# EAGLE design eagle (EAGLE 6.6.0)
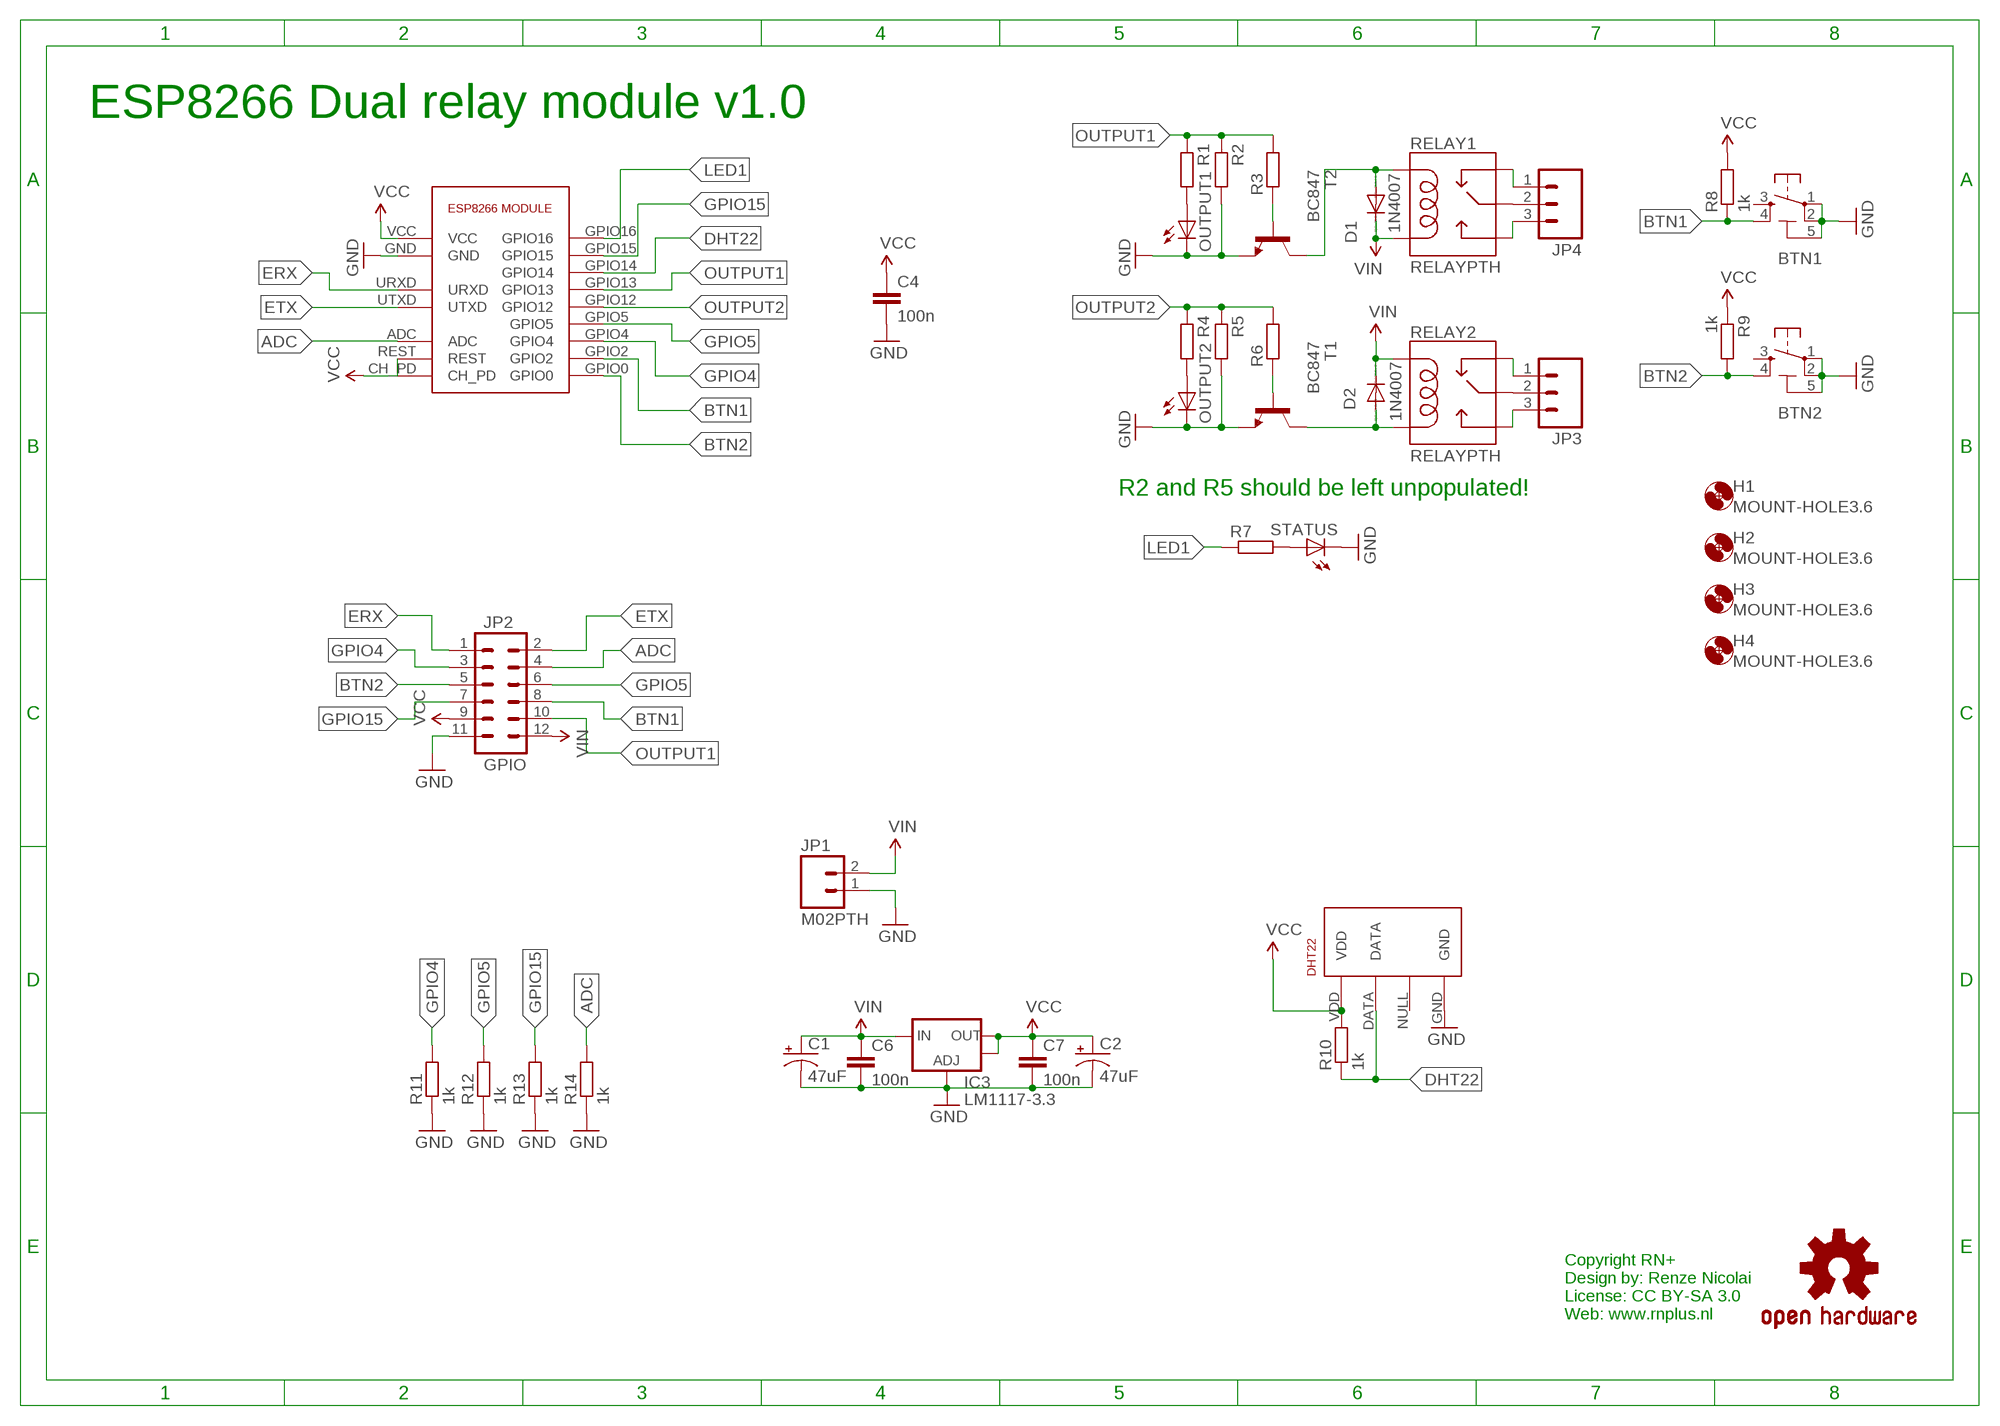
[diagram p0: schematic, sheet 1]

## Parts
BTN1  SMARTPRJ_TS42  [SMARTPRJ_TS42]
BTN2  SMARTPRJ_TS42  [SMARTPRJ_TS42]
C1  47uF  CAP_POLD  [PANASONIC_D]
C2  47uF  CAP_POLD  [PANASONIC_D]
C4  100n  C-EUC0805K  [C0805K]
C6  100n  C-EUC0805K  [C0805K]
C7  100n  C-EUC0805K  [C0805K]
D1  1N4942  [DO41-10]
D2  1N4942  [DO41-10]
DHT22  RHT03_DHT-22_AM2302  [RHT03_DHT-22]
ESP8266  ESP8266ESP-07  [ESP-12]
H1  MOUNT-HOLE3.6  [3,6]
H2  MOUNT-HOLE3.6  [3,6]
H3  MOUNT-HOLE3.6  [3,6]
H4  MOUNT-HOLE3.6  [3,6]
IC3  LM1117-3.3  V_REG_LM1117SOT223  [SOT223]
JP1  M02PTH  [1X02]
JP2  GPIO  M06X2PTH_FEMALE  [2X6]
JP3  M03-SCREW-5MM  [SCREWTERMINAL-5MM-3]
JP4  M03-SCREW-5MM  [SCREWTERMINAL-5MM-3]
LOGO1  OSHW-LOGOL  [OSHW-LOGO-L]
OUTPUT1  LEDCHIP-LED0805  [CHIP-LED0805]
OUTPUT2  LEDCHIP-LED0805  [CHIP-LED0805]
R1  SMARTPRJ_R-EU_M0805  [SMARTPRJ_M0805]
R2  SMARTPRJ_R-EU_M0805  [SMARTPRJ_M0805]
R3  SMARTPRJ_R-EU_M0805  [SMARTPRJ_M0805]
R4  SMARTPRJ_R-EU_M0805  [SMARTPRJ_M0805]
R5  SMARTPRJ_R-EU_M0805  [SMARTPRJ_M0805]
R6  SMARTPRJ_R-EU_M0805  [SMARTPRJ_M0805]
R7  SMARTPRJ_R-EU_M0805  [SMARTPRJ_M0805]
R8  1k  SMARTPRJ_R-EU_M0805  [SMARTPRJ_M0805]
R9  1k  SMARTPRJ_R-EU_M0805  [SMARTPRJ_M0805]
R10  1k  SMARTPRJ_R-EU_M0805  [SMARTPRJ_M0805]
R11  1k  SMARTPRJ_R-EU_M0805  [SMARTPRJ_M0805]
R12  1k  SMARTPRJ_R-EU_M0805  [SMARTPRJ_M0805]
R13  1k  SMARTPRJ_R-EU_M0805  [SMARTPRJ_M0805]
R14  1k  SMARTPRJ_R-EU_M0805  [SMARTPRJ_M0805]
RELAY1  RELAYPTH  [SRD-05VDC-SL-C]
RELAY2  RELAYPTH  [SRD-05VDC-SL-C]
STATUS  LEDCHIP-LED0805  [CHIP-LED0805]
T1  BC847  [SOT23]
T2  BC847  [SOT23]

## Nets
ADC: ESP8266.ADC JP2.4 R14.2
BTN1: BTN1.4 ESP8266.GPIO2 JP2.8 R8.1
BTN2: BTN2.4 ESP8266.GPIO0 JP2.5 R9.2
DHT22: DHT22.DATA ESP8266.GPIO14 R10.1
ERX: ESP8266.URXD JP2.1
ETX: ESP8266.UTXD JP2.2
GND: BTN1.1 BTN1.2 BTN1.5(5-GND) BTN2.1 BTN2.2 BTN2.5(5-GND) C1.- C2.- C4.2 C6.2 C7.2 DHT22.GND ESP8266.GND IC3.1(ADJ) JP1.1 JP2.11 OUTPUT1.C OUTPUT2.C R2.2 R5.2 R11.1 R12.1 R13.1 R14.1 STATUS.C T1.2(E) T2.2(E)
GPIO4: ESP8266.GPIO4 JP2.3 R11.2
GPIO5: ESP8266.GPIO5 JP2.6 R12.2
GPIO15: ESP8266.GPIO15 JP2.7 R13.2
LED1: ESP8266.GPIO16 R7.1
N$1: D2.A RELAY2.COIL0 T1.3(C)
N$2: D1.A RELAY1.COIL1 T2.3(C)
N$3: JP3.2 RELAY2.SWCOMMON
N$4: JP4.2 RELAY1.SWCOMMON
N$5: JP4.1 RELAY1.SWCLOSED(SWCLOSE)
N$6: JP4.3 RELAY1.SWOPEN
N$7: JP3.3 RELAY2.SWOPEN
N$8: JP3.1 RELAY2.SWCLOSED(SWCLOSE)
N$9: R3.1 T2.1(B)
N$10: R6.1 T1.1(B)
N$13: OUTPUT2.A R4.2
N$14: R7.2 STATUS.A
N$17: OUTPUT1.A R1.2
OUTPUT1: ESP8266.GPIO13 JP2.10 R1.1 R2.1 R3.2
OUTPUT2: ESP8266.GPIO12 R4.1 R5.1 R6.2
VCC: C2.+ C4.1 C7.1 DHT22.VDD ESP8266.CH_PD ESP8266.REST ESP8266.VCC IC3.2(OUT) IC3.4(OUT) JP2.9 R8.2 R9.1 R10.2
VIN: C1.+ C6.1 D1.C D2.C IC3.3(IN) JP1.2 JP2.12 RELAY1.COIL0 RELAY2.COIL1
Unconnected: BTN1.3 BTN2.3 DHT22.NULL

## Notes on the sheet
- ESP8266 Dual relay module v1.0
- 1N4007
- 1N4007
- R2 and R5 should be left unpopulated!
- Copyright RN+
  Design by: Renze Nicolai
  License: CC BY-SA 3.0
  Web: www.rnplus.nl

## Library data of the parts
BTN1 BTN2 = arduino_Uno_Rev3-02-TH:SMARTPRJ_TS42: TS42 Dongnan Electronics Tact switch VDC 12V - 50mA
C1 C2 = SparkFun-Capacitors:CAP_POL: Capacitor Polarized These are standard SMD and PTH capacitors. Normally 10uF, 47uF, and 100uF in electrolytic and tantalum varieties. Always verify the external diameter of the through hole cap, it varies with capacity, voltage, and manufacturer. The EIA devices should be standard.
C4 C6 C7 = rcl:C-EU: CAPACITOR, European symbol
D1 D2 = diode:1N4942: DIODE 1.0 A, 200 V, 150 ns
DHT22 = dht:RHT03_DHT-22_AM2302: RHT03 / DHT-22 / AM2302 Packages and symbol for the RHT03 / DHT-22 relative humidity and temperature sensor. Note: The AM2302 is a wired version of the DHT-22 which typically requires less clearance and is thus provided as a separate package.; PROD_ID: SEN-10167
ESP8266 = esp:ESP8266
H1-H4 = holes:MOUNT-HOLE: MOUNTING HOLE with drill center marker
IC3 = SparkFun-PowerIC:V_REG_LM1117: Voltage Regulator LM1117 Standard adjustable voltage regulator but in SMD form. Spark Fun Electronics SKU : COM-00595
JP1 = SparkFun-Connectors:M02: Standard 2-pin 0.1" header. Use with - straight break away headers ( PRT-00116) - right angle break away headers (PRT-00553) - swiss pins (PRT-00743) - machine pins (PRT-00117) - female headers (PRT-00115) Molex polarized connector foot print use with: PRT-08233 with associated crimp pins and housings. 2.54_SCREWTERM for use with PRT-10571. 3.5mm Screw Terminal footprints for PRT-08084 5mm Screw Terminal footprints for use with PRT-08432
JP2 = SparkFun-Connectors:M06X2; PROD_ID: CONN-12423; VALUE: 2X6 FEMALE
JP3 JP4 = SparkFun-Connectors:M03: Header 3 Standard 3-pin 0.1" header. Use with straight break away headers (SKU : PRT-00116), right angle break away headers (PRT-00553), swiss pins (PRT-00743), machine pins (PRT-00117), and female headers (PRT-00115). Molex polarized connector foot print use with SKU : PRT-08232 with associated crimp pins and housings.; STOREFRONT_ID: PRT-08433
LOGO1 = SparkFun-Aesthetics:OSHW-LOGO: Open Source Hardware Logo This logo indicates the piece of hardware it is found on incorporates a OSHW license and/or adheres to the definition of open source hardware found here: http://freedomdefined.org/OSHW
OUTPUT1 OUTPUT2 STATUS = led:LED: LED OSRAM: - CHIPLED LG R971, LG N971, LY N971, LG Q971, LY Q971, LO R971, LY R971 LH N974, LH R974 LS Q976, LO Q976, LY Q976 LO Q996 - Hyper CHIPLED LW Q18S LB Q993, LB Q99A, LB R99A - SideLED LS A670, LO A670, LY A670, LG A670, LP A670 LB A673, LV A673, LT A673, LW A673 LH A674 LY A675 LS A676, LA A676, LO A676, LY A676, LW A676 LS A679, LY A679, LG A679 - Hyper Micro SIDELED® LS Y876, LA Y876, LO Y876, LY Y876 LT Y87S - SmartLED LW L88C, LW L88S LB L89C, LB L89S, LG L890 LS L89K, LO L89K, LY L89K LS L896, LA L896, LO L896, LY L896 - TOPLED LS T670, LO T670, LY T670, LG T670, LP T670 LSG T670, LSP T670, LSY T670, LOP T670, LYG T670 LG T671, LOG T671, LSG T671 LB T673, LV T673, LT T673, LW T673 LH T674 LS T676, LA T676, LO T676, LY T676, LB T676, LH T676, LSB T676, LW T676 LB T67C, LV T67C, LT T67C, LS T67K, LO T67K, LY T67K, LW E67C LS E67B, LA E67B, LO E67B, LY E67B, LB E67C, LV E67C, LT E67C LW T67C LS T679, LY T679, LG T679 LS T770, LO T770, LY T770, LG T770, LP T770 LB T773, LV T773, LT T773, LW T773 LH T774 LS E675, LA E675, LY E675, LS T675 LS T776, LA T776, LO T776, LY T776, LB T776 LHGB T686 LT T68C, LB T68C - Hyper Mini TOPLED® LB M676 - Mini TOPLED Santana® LG M470 LS M47K, LO M47K, LY M47K Source: http://www.osram.convergy.de LUXEON: - LUMILED® LXK2-PW12-R00, LXK2-PW12-S00, LXK2-PW14-U00, LXK2-PW14-V00 LXK2-PM12-R00, LXK2-PM12-S00, LXK2-PM14-U00 LXK2-PE12-Q00, LXK2-PE12-R00, LXK2-PE12-S00, LXK2-PE14-T00, LXK2-PE14-U00 LXK2-PB12-K00, LXK2-PB12-L00, LXK2-PB12-M00, LXK2-PB14-N00, LXK2-PB14-P00, LXK2-PB14-Q00 LXK2-PR12-L00, LXK2-PR12-M00, LXK2-PR14-Q00, LXK2-PR14-R00 LXK2-PD12-Q00, LXK2-PD12-R00, LXK2-PD12-S00 LXK2-PH12-R00, LXK2-PH12-S00 LXK2-PL12-P00, LXK2-PL12-Q00, LXK2-PL12-R00 Source: www.luxeon.com KINGBRIGHT: KA-3528ASYC Source: www.kingbright.com
R1-R14 = arduino_Uno_Rev3-02-TH:SMARTPRJ_R-EU_: RESISTOR, European symbol
RELAY1 RELAY2 = srd-05vdc-sl-c:RELAY: SPDT relay (COM-00101)
T1 T2 = transistor:BC847: NPN TRANSISTOR

## Net classes
0 default: clearance 0.205 mm

## Board
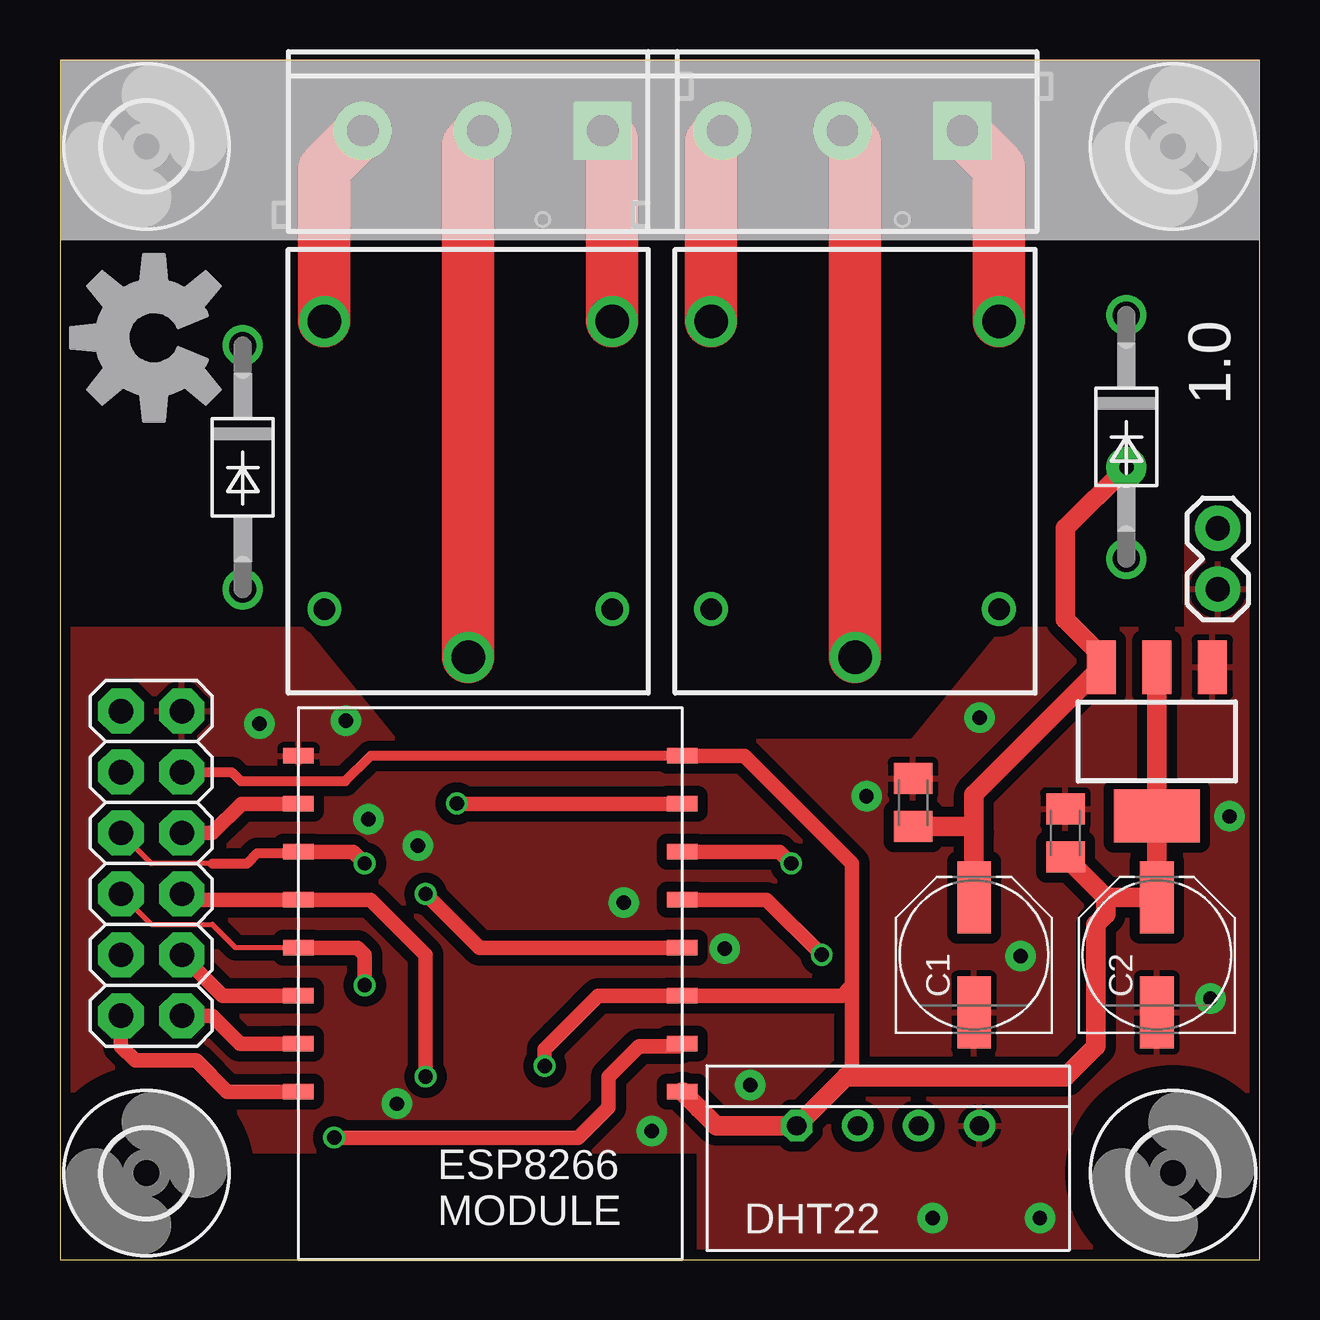
[diagram p1: board, top side]
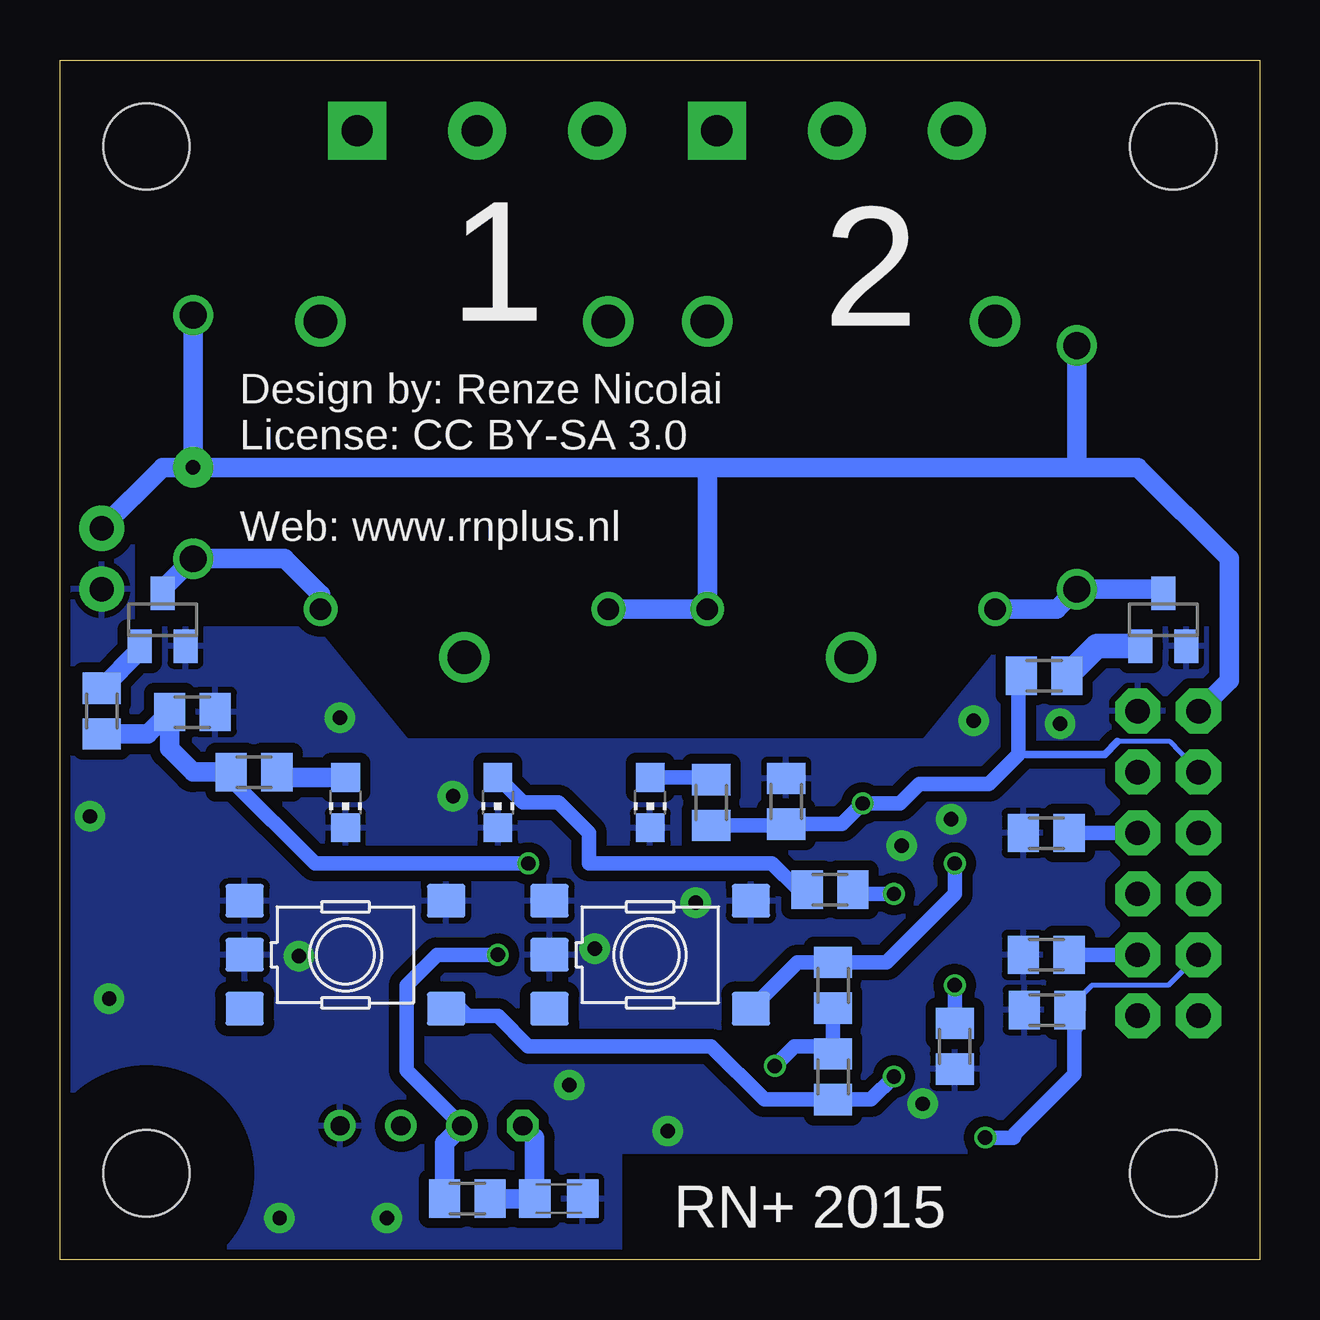
[diagram p2: board, bottom side, seen from below]

Size 50 x 50 mm. Coordinates in mm from the lower left corner, seen from the top.
Outline: 50,0 50,50 0,50 0,0 50,0
Copper layers (1*16): Top 0.035mm / dielectric 1.5mm / Bottom 0.035mm
Design rules "dirt_cheap_dirty_boards.v1": minimum track width 5mil, minimum drill 12mil, track to track 5mil, track to pad 5mil, pad to pad 5mil, via to via 5mil, smd to smd 0mil, copper to edge 10mil, drill to drill 10mil, minimum pad ring 10mil, minimum via ring 6mil, stop-mask expansion 2mil, vias tented up to drill 25mil, thermal gap 10mil

### Footprints (pad centres in the part's own frame; a part is rotated, then mirrored left to right if it is on the bottom)
SMARTPRJ_TS42 = smd 1.6 x 1.4: 1 -4.2,2.25; 2 4.2,2.25; 3 -4.2,-2.25; 4 4.2,-2.25; 5 -4.2,0
PANASONIC_D = smd 3 x 1.4: + 2.4,0; - -2.4,0
C0805K = smd 1.3 x 1.6: 1 -1,0; 2 1,0
DO41-10 = drill 1.118: A 5.08,0; C -5.08,0
RHT03_DHT-22 = drill 0.8: DATA -1.27,0; GND 3.81,0; NULL 1.27,0 | drill 0.8 octagon: VDD -3.81,0
ESP-12 = smd 0.635 x 1.27: ADC 9,0; CH_PD 11,0; GND 21,16; GPIO0 15,16; GPIO2 17,16; GPIO4 11,16; GPIO5 13,16; GPIO12 17,0; GPIO13 19,0; GPIO14 15,0; GPIO15 19,16; GPIO16 13,0; REST 7,0; URXD 9,16; UTXD 7,16; VCC 21,0
3,6 = hole 3.6: 0,0
SOT223 = smd 1.219 x 2.235: 1 -2.311,-3.099; 2 0,-3.099; 3 2.311,-3.099 | smd 3.6 x 2.2: 4 0,3.099
1X02 = drill 1.016 pad 1.88: 1 0,0; 2 2.54,0
2X6 = drill 1.016 pad 1.88 octagon: 1 0,0; 2 0,2.54; 3 2.54,0; 4 2.54,2.54; 5 5.08,0; 6 5.08,2.54; 7 7.62,0; 8 7.62,2.54; 9 10.16,0; 10 10.16,2.54; 11 12.7,0; 12 12.7,2.54
SCREWTERMINAL-5MM-3 = drill 1.3 pad 2.413 square: 1 0,0 | drill 1.3 pad 2.413: 2 5,0; 3 10,0
CHIP-LED0805 = smd 1.2 x 1.2: A 0,-1.05; C 0,1.05
SMARTPRJ_M0805 = smd 1.3 x 1.6: 1 -0.95,0; 2 0.95,0
SRD-05VDC-SL-C = drill 0.9: COIL0 -5.39,-6.12; COIL1 -5.39,5.88 | drill 1.4: SWCLOSED 6.61,-6.12; SWCOMMON -7.39,-0.12; SWOPEN 6.61,5.88
SOT23 = smd 1 x 1.4: 1 -0.95,-1.1; 2 0.95,-1.1; 3 0,1.1

### Placement (x,y rotation side)
BTN1  25.4,12.7 0 bottom
BTN2  38.1,12.7 0 bottom
C1  38.1,12.7 90 top
C2  45.72,12.7 90 top
C4  29.21,2.54 0 bottom
C6  35.56,19.05 90 top
C7  41.91,17.78 90 top
D1  7.62,33.02 270 top
D2  44.45,34.29 270 top
DHT22  34.52,5.58 0 top
ESP8266  25.94,0 90 top
H1  3.6,46.4 0 top
H2  3.6,3.6 0 top
H3  46.4,3.6 0 top
H4  46.4,46.4 0 top
IC3  45.72,21.59 180 top
JP1  48.26,27.94 90 top
JP2  5.08,10.16 90 top
JP3  37.61,47.05 180 top
JP4  22.62,47.05 180 top
LOGO1  3.92,38.42 90 top
OUTPUT1  25.4,19.05 180 bottom
OUTPUT2  38.1,19.05 180 bottom
R1  22.86,19.05 90 bottom
R2  19.73,19.1 90 bottom
R3  8.98,24.33 180 bottom
R4  41.91,20.32 0 bottom
R5  44.48,22.82 0 bottom
R6  48.26,22.86 270 bottom
R7  17.9,15.42 180 bottom
R8  17.78,11.43 270 bottom
R9  17.78,7.62 270 bottom
R10  33.02,2.54 0 bottom
R11  8.89,12.7 0 bottom
R12  12.7,8.89 90 bottom
R13  8.89,17.78 0 bottom
R14  8.86,10.4 0 bottom
RELAY1  16.9,32.5 90 top
RELAY2  33.02,32.5 90 top
STATUS  31.75,19.05 180 bottom
T1  45.72,26.67 0 bottom
T2  4.01,26.67 0 bottom

### Tracks (layer width: path | path; a pad name or v marks a point on that pad's centre or on a via)
ADC  (via drill 0.6 pad 0.41)
  Top 0.305: 25.83,8.89 ESP8266.ADC
  Top 0.61: 25.83,8.89 24.13,8.89 22.86,7.62 22.86,6.35 21.59,5.08 v11.43,5.08
  Bottom 0.203: 7.38,11.04 6.98,11.43 3.81,11.43 JP2.4
  Bottom 0.254: R14.2 7.62,10.4
  Bottom 0.305: 7.94,9.84 7.62,10.16 7.38,10.4 7.38,11.04
  Bottom 0.406: 7.62,10.4 7.62,10.16 7.62,9.72
  Bottom 0.61: 7.62,9.72 7.71,9.63 7.71,7.73 10.21,5.23 10.21,5.14 10.27,5.08 v11.43,5.08
BTN1  (via drill 0.6 pad 0.41)
  Top 0.203: JP2.8 3.81,16.51 6.35,16.51
  Top 0.406: 6.35,16.51 7.8,16.51 8.23,16.94 9.88,16.94 ESP8266.GPIO2
  Top 0.61: ESP8266.GPIO2 12.21,17 v12.7,16.51
  Bottom 0.61: v12.7,16.51 12.7,15.24 15.56,12.38 R8.1 19.27,12.38 BTN1.4
BTN2  (via drill 0.6 pad 0.41)
  Top 0.61: v15.24,7.62 15.24,12.7 12.94,15 ESP8266.GPIO0 5.32,15 JP2.5
  Bottom 0.61: BTN2.4 33.31,10.45 33.02,10.16 31.75,10.16 30.48,8.89 22.86,8.89 20.64,6.67 R9.2 16.19,6.67 v15.24,7.62
DHT22  (via drill 0.6 pad 0.41)
  Top 0.61: ESP8266.GPIO14 29.45,15 v31.75,12.7
  Bottom 0.61: v31.75,12.7 34.29,12.7 35.56,11.43 35.56,7.89 DHT22.DATA
  Bottom 0.813: R10.1 33.97,4.85 DHT22.DATA
ERX
  Top 0.61: ESP8266.URXD 7.51,9 6.35,10.16 JP2.1
ETX
  Top 0.61: ESP8266.UTXD 6.97,7 5.67,8.3 3.13,8.3 2.54,8.89 JP2.2
GND  (via drill 0.6 pad 1.27)
  other vias: 24.67,5.35 36.38,1.73 28.77,7.26 40.05,12.65 27.71,12.96 38.33,22.59 48.74,18.47 33.62,19.32 12.86,18.35 47.95,10.88 14.92,17.25 11.92,22.46 14.04,6.49 40.85,1.73 23.5,14.87 8.32,22.33
  pour Top (isolate 0.432): 0,26.27 10.16,26.27 13.97,21.59 35.56,21.59 39.37,26.27 46.99,26.27 46.99,32.62 50,32.62 50,0 26.67,0 26.67,4.54 0.22,4.54 0,19.27
  pour Bottom (isolate 0.432): 26.67,0 26.67,4.54 0.22,4.54 0,19.27 0,26.27 10.16,26.27 13.97,21.59 35.56,21.59 39.37,26.27 46.99,26.27 46.99,32.62 50,32.62 50,0
GPIO4
  Top 0.61: ESP8266.GPIO4 6.78,11 JP2.3
  Bottom 0.61: R11.2 JP2.3
GPIO5  (via drill 0.6 pad 0.3)
  Top 0.203: JP2.6 3.81,13.97 6.35,13.97 7.32,13 ESP8266.GPIO5
  Top 0.61: ESP8266.GPIO5 12.4,13 12.7,12.7 v12.7,11.43
  Bottom 0.61: R12.2 v12.7,11.43
GPIO15
  Top 0.61: ESP8266.GPIO15 7.57,19 6.35,17.78 JP2.7
  Bottom 0.61: R13.2 JP2.7
LED1  (via drill 0.6 pad 0.41)
  Top 0.61: ESP8266.GPIO16 17.48,13 v15.24,15.24
  Bottom 0.61: v15.24,15.24 16.77,15.24 R7.1
N$1
  Bottom 0.813: RELAY2.COIL0 39.14,27.71 40.64,29.21 D2.A 45.72,27.94 T1.3
N$2
  Bottom 0.813: RELAY1.COIL1 8.45,27.11 D1.A 4.18,27.94 T2.3
N$3
  Top 2.184: RELAY2.SWCOMMON 33.14,46.52 JP3.2
N$4
  Top 2.184: RELAY1.SWCOMMON 17.02,46.45 JP4.2
N$5
  Top 2.184: RELAY1.SWCLOSED 23.02,46.65 JP4.1
N$6
  Top 2.184: RELAY1.SWOPEN 11.02,45.45 JP4.3
N$7
  Top 2.184: RELAY2.SWOPEN 27.14,46.58 JP3.3
N$8
  Top 2.184: RELAY2.SWCLOSED 39.14,45.52 JP3.1
N$9
  Bottom 1.016: T2.1 6.79,25.57 R3.1
N$10
  Bottom 0.813: T1.1 46.67,25.4 R6.1
N$13
  Bottom 0.813: OUTPUT2.A 40.74,20.1 R4.2
N$14
  Bottom 0.61: R7.2 19.23,15.42 20.32,16.51 27.94,16.51 27.94,17.78 29.21,19.05 30.7,19.05 STATUS.A
N$17
  Bottom 0.61: OUTPUT1.A 22.96,20.1 R1.2
OUTPUT1  (via drill 0.6 pad 0.41)
  Top 0.61: ESP8266.GPIO13 v16.56,19 v16.55,19.01
  Bottom 0.203: 5.93,21.58 3.73,21.58 JP2.10
  Bottom 0.305: 10.05,21.05 6.46,21.05 5.93,21.58
  Bottom 0.61: R1.1 19.78,18.1 R2.1 17.41,18.15 v16.55,19.01 15,19.01 14.19,19.82 11.28,19.82 10.05,21.05 10.05,24.21 R3.2
OUTPUT2  (via drill 0.6 pad 0.41)
  Top 0.61: ESP8266.GPIO12 29.99,17 v30.48,16.51
  Bottom 0.61: R4.1 42.86,20 39.37,16.51 v30.48,16.51
  Bottom 0.813: R6.2 46.34,21.91 R5.1 45.43,21.3 44.45,20.32 R4.1
VCC  (via drill 0.6 pad 0.41)
  Top 0.406: JP2.9 7.16,20.32 7.54,19.94 11.89,19.94 12.95,21 ESP8266.VCC
  Top 0.61: ESP8266.VCC 28.53,21 33.02,16.51 33.02,11.43 | 33.02,11.43 33.02,7.62 | 33.02,11.43 32.59,11 ESP8266.CH_PD 22.43,11 20.2,8.77 v20.2,8.07 | 26.59,6.35 26.63,6.31
  Top 0.813: IC3.2 IC3.4 C2.+ 43.59,15.1 | 43.59,15.1 C7.1 | 43.59,15.1 43.59,14.38 43.18,13.97 43.18,8.89 41.91,7.62 33.02,7.62 32.75,7.62 DHT22.VDD 27.36,5.58 26.63,6.31 ESP8266.REST
  Bottom 0.61: R8.2 R9.1 18.1,8.89 19.38,8.89 v20.2,8.07
  Bottom 0.813: R10.2 C4.1 30.21,5.08 DHT22.VDD
VIN  (via drill 0.6 pad 1.68)
  Top 0.813: C1.+ 38.1,17.78 | 38.1,17.78 38.1,19.38 IC3.3 43.41,25.17 41.91,26.67 41.91,30.48 v44.45,33.02 | C6.1 37.83,18.05 38.1,17.78
  Bottom 0.813: 7.62,33.02 5.08,33.02 1.27,29.21 1.27,24.13 JP2.12 | 7.62,33.02 22.75,33.02 | 22.75,33.02 v44.45,33.02 | RELAY2.COIL1 RELAY1.COIL0 23.02,32.75 22.75,33.02 | v44.45,33.02 45.72,33.02 JP1.2 | D1.C 7.62,33.02 | D2.C v44.45,33.02

### Text on the board
tPlace: 1.0
bPlace: 2 | 1 | Design by: Renze Nicolai / License: CC BY-SA 3.0 / / Web: www.rnplus.nl | RN+ 2015
_bplace: 4